# Altium project Passive_Sonar_Rev2.PrjPcb
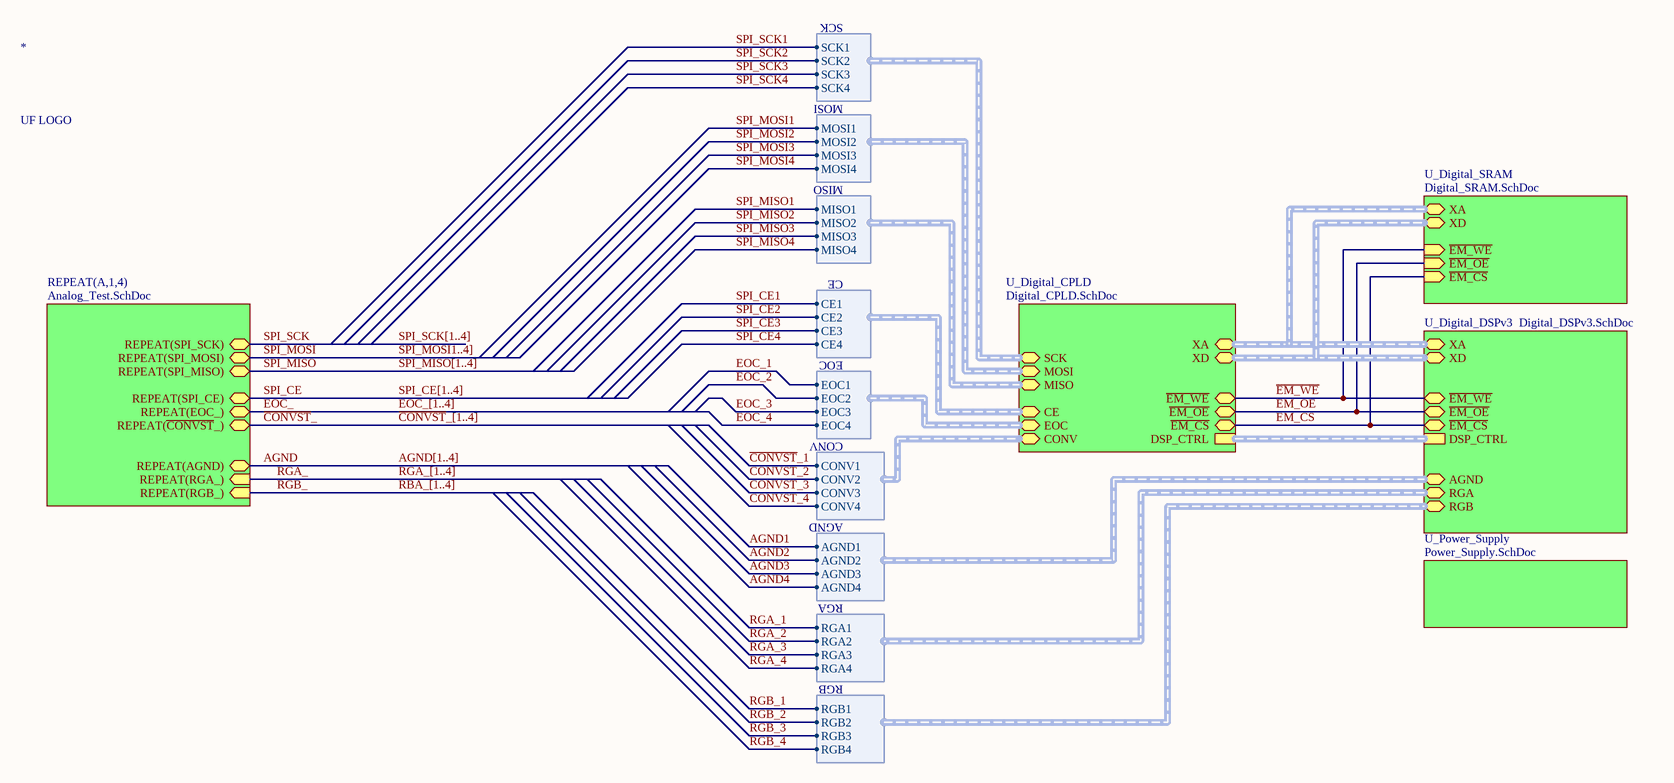
[diagram p0: Top_Level_3.SchDoc]
6 sheets, 265 parts. Net scope: hierarchical (ports join the sheet entries above them; power ports are global).
Board file: Board_Design.PcbDoc
Sheets:
  Top_Level_3.SchDoc
    A1 = Analog_Test.SchDoc
    A2 = Analog_Test.SchDoc
    A3 = Analog_Test.SchDoc
    A4 = Analog_Test.SchDoc
    U_Power_Supply = Power_Supply.SchDoc
    U_Digital_SRAM = Digital_SRAM.SchDoc
    U_Digital_CPLD = Digital_CPLD.SchDoc
  Digital_DSP.SchDoc

## Sheet Top_Level_3.SchDoc
size 381 x 241 mm

### Parts
*  UF LOGO  [UF LOGO-1000]
MIL  MIL LOGO  [MIL LOGO - 500]  (value not drawn)

### Sub-sheets
REPEAT(A,1,4) = Analog_Test.SchDoc: REPEAT(RGA_) (in), REPEAT(RGB_) (in), REPEAT(SPI_SCK) (bidir), REPEAT(SPI_MISO) (bidir), REPEAT(SPI_CE) (bidir), REPEAT(~{CONVST}_) (bidir), REPEAT(EOC_) (bidir), REPEAT(AGND) (bidir), REPEAT(SPI_MOSI) (bidir)
U_Digital_CPLD = Digital_CPLD.SchDoc: ~{EM_OE} (bidir), ~{EM_CS} (bidir), ~{EM_WE} (bidir), DSP_CTRL (harness DSP_CTRL), XA (harness XA), XD (harness XD), SCK (harness SCK), MOSI (harness MOSI), MISO (harness MISO), CE (harness CE), EOC (harness EOC), CONV (harness CONV)
U_Digital_DSPv3 = Digital_DSPv3.SchDoc (file not in this document): ~{EM_WE} (bidir), ~{EM_OE} (bidir), ~{EM_CS} (bidir), DSP_CTRL (harness DSP_CTRL), XA (harness XA), XD (harness XD), AGND (harness AGND), RGA (harness RGA), RGB (harness RGB)
U_Digital_SRAM = Digital_SRAM.SchDoc: ~{EM_CS} (in), ~{EM_WE} (in), ~{EM_OE} (in), XD (harness XD), XA (harness XA)
U_Power_Supply = Power_Supply.SchDoc: no entries

### Harnesses
SCK: SCK1, SCK2, SCK3, SCK4
MOSI: MOSI1, MOSI2, MOSI3, MOSI4
MISO: MISO1, MISO2, MISO3, MISO4
CE: CE1, CE2, CE3, CE4
EOC: EOC1, EOC2, EOC3, EOC4
CONV: CONV1, CONV2, CONV3, CONV4
AGND: AGND1, AGND2, AGND3, AGND4
RGA: RGA1, RGA2, RGA3, RGA4
RGB: RGB1, RGB2, RGB3, RGB4

### Nets
AGND: sheet REPEAT(A,1,4)/REPEAT(AGND)
~{CONVST}_: sheet REPEAT(A,1,4)/REPEAT(~{CONVST}_)
~{EM_CS}: sheet U_Digital_DSPv3/~{EM_CS}, sheet U_Digital_SRAM/~{EM_CS}, sheet U_Digital_CPLD/~{EM_CS}
~{EM_OE}: sheet U_Digital_DSPv3/~{EM_OE}, sheet U_Digital_SRAM/~{EM_OE}, sheet U_Digital_CPLD/~{EM_OE}
~{EM_WE}: sheet U_Digital_DSPv3/~{EM_WE}, sheet U_Digital_SRAM/~{EM_WE}, sheet U_Digital_CPLD/~{EM_WE}
EOC_: sheet REPEAT(A,1,4)/REPEAT(EOC_)
RGA_: sheet REPEAT(A,1,4)/REPEAT(RGA_)
RGB_: sheet REPEAT(A,1,4)/REPEAT(RGB_)
SPI_CE: sheet REPEAT(A,1,4)/REPEAT(SPI_CE)
SPI_MISO: sheet REPEAT(A,1,4)/REPEAT(SPI_MISO)
SPI_MOSI: sheet REPEAT(A,1,4)/REPEAT(SPI_MOSI)
SPI_SCK: sheet REPEAT(A,1,4)/REPEAT(SPI_SCK)

### Buses and harness runs
bus AGND[1..4]
bus EOC_[1..4]
bus RBA_[1..4]
bus RGA_[1..4]
bus SPI_CE[1..4]
bus SPI_MISO[1..4]
bus SPI_MOSI1..4]
bus SPI_SCK[1..4]
bus ~{CONVST}_[1..4]
harness sheet U_Digital_CPLD/DSP_CTRL = sheet U_Digital_DSPv3/DSP_CTRL
harness sheet U_Digital_CPLD/XA = sheet U_Digital_DSPv3/XA = sheet U_Digital_SRAM/XA
harness sheet U_Digital_CPLD/XD = sheet U_Digital_DSPv3/XD = sheet U_Digital_SRAM/XD

## Sheet Analog_Test.SchDoc
size A
Used 4 times, as channels A1, A2, A3, A4. Parts and nets are listed once, with the designators drawn on the sheet.
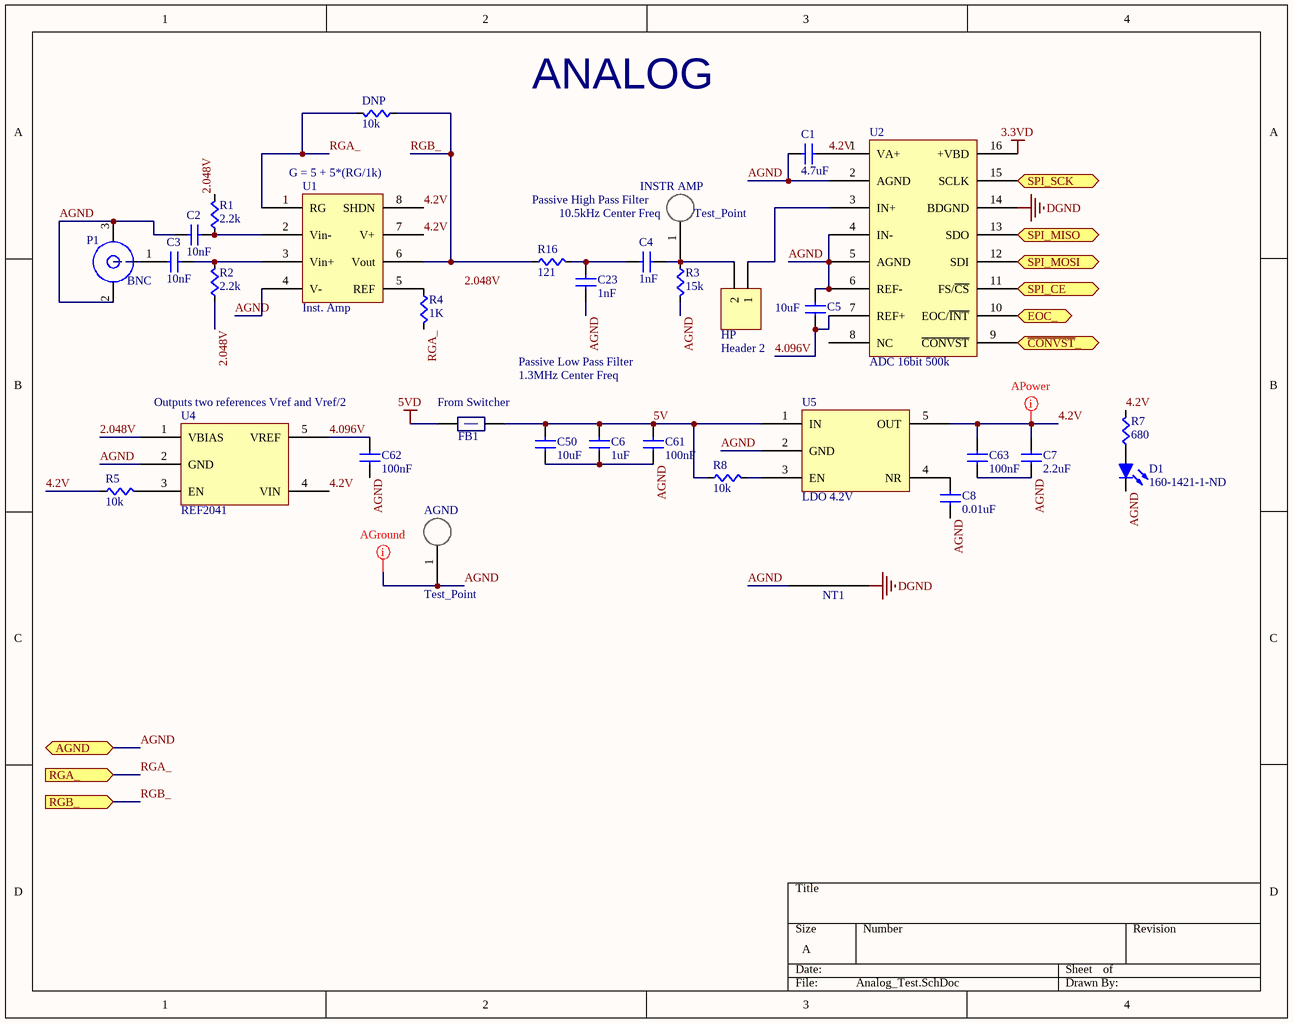
[diagram p1: Analog_Test.SchDoc]

### Parts
AGND  Test_Point  [TP]
C1  value 4.7uF  [CAPC0603]  (hidden comment: Cap)
C2  value 10nF  [CAPC0603]  (hidden comment: Cap)
C3  value 10nF  [CAPC0603]  (hidden comment: Cap)
C4  value 1nF  [CAPC0603]  (hidden comment: Cap)
C5  value 10uF  [CAPC0603]  (hidden comment: Cap)
C6  value 1uF  [CAPC0603]  (hidden comment: Cap)
C7  value 2.2uF  [CAPC0603]  (hidden comment: Cap)
C8  value 0.01uF  [CAPC0603]  (hidden comment: Cap)
C23  value 1nF  [CAPC0603]  (hidden comment: Cap)
C50  value 10uF  [CAPC0603]  (hidden comment: Cap)
C61  value 100nF  [CAPC0603]  (hidden comment: Cap)
C62  value 100nF  [CAPC0603]  (hidden comment: Cap)
C63  value 100nF  [CAPC0603]  (hidden comment: Cap)
D1  Supplier Part Number: 160-1421-1-ND  [LED0805-RED]  (hidden comment: LED-RED)
DNP  value 10k  [RES0603]  (hidden comment: Res)
FB1  FBead  [RES0603]  (value not drawn)
HP  Header 2  [HDR1X2]
INSTR_AMP  Test_Point  [TP]
NT1  NetTie  [NT_5mil]  (value not drawn)  (net tie, no BOM)
P1  BNC  [BNC Connector]
R1  value 2.2k  [RES0603]  (hidden comment: Res)
R2  value 2.2k  [RES0603]  (hidden comment: Res)
R3  value 15k  [RES0603]  (hidden comment: Res)
R4  value 1K  [RES0603]  (hidden comment: Res)
R5  value 10k  [RES0603]  (hidden comment: Res)
R7  value 680  [RES0603]  (hidden comment: Res)
R8  value 10k  [RES0603]  (hidden comment: Res)
R16  value 121  [RES0603]  (hidden comment: Res)
U1  Inst. Amp  [TSSOP-8n]
U2  ADC 16bit 500k  [TSSOP-16pin]
U4  REF2041  [SOT23-5]
U5  LDO 4.2V  [sot23-5]

### Ports
AGND (bidir), EOC_ (bidir), RGA_ (in), RGB_ (in), SPI_CE (bidir), SPI_MISO (bidir), SPI_MOSI (bidir), SPI_SCK (bidir), ~{CONVST}_ (bidir)

### Nets
3.3VD: U2.16(+VBD)
5VD: FB1.1(A)
DGND: NT1.2 U2.14(BDGND)
2.048V: R1.1(A) R2.2(B) U4.1(VBIAS)
4.2V: C1.2(B) C7.2(B) C63.1(A) R5.2(B) R7.1(A) U1.7(V+) U1.8(SHDN) U2.1(VA+) U4.4(VIN) U5.5(OUT)
4.096V: C5.2(B) C62.1(A) U2.7(REF+) U4.5(VREF)
5V: C6.2(B) C50.1(A) C61.1(A) FB1.2(B) R8.2(B) U5.1(IN)
AGND: AGND.1 C1.1(A) C2.1(A) C5.1(A) C6.1(A) C7.1(A) C8.1(A) C23.1(A) C50.2(B) C61.2(B) C62.2(B) C63.2(B) D1.1(K) NT1.1 P1.2(GND) P1.3(GND) R3.1(A) U1.4(V-) U2.2(AGND) U2.4(IN-) U2.5(AGND) U2.6(REF-) U4.2(GND) U5.2(GND) ; port AGND
~{CONVST}_: U2.9(~{CONVST}) ; port ~{CONVST}_
EOC_: U2.10(EOC/~{INT}) ; port EOC_
RGA_: DNP.1(A) R4.1(A) U1.1(RG) ; port RGA_
RGB_: DNP.2(B) R16.2(B) U1.6(Vout) ; port RGB_
SPI_CE: U2.11(FS/~{CS}) ; port SPI_CE
SPI_MISO: U2.13(SDO) ; port SPI_MISO
SPI_MOSI: U2.12(SDI) ; port SPI_MOSI
SPI_SCK: U2.15(SCLK) ; port SPI_SCK
NetC2_2: C2.2(B) R1.2(B) U1.2(Vin-)
NetC3_1: C3.1(A) P1.1(Signal)
NetC3_2: C3.2(B) R2.1(A) U1.3(Vin+)
NetC4_1: C4.1(A) C23.2(B) R16.1(A)
NetC4_2: C4.2(B) HP.2 INSTR_AMP.1 R3.2(B)
NetC8_2: C8.2(B) U5.4(NR)
NetD1_2: D1.2(A) R7.2(B)
NetHP_1: HP.1 U2.3(IN+)
NetR4_2: R4.2(B) U1.5(REF)
NetR5_1: R5.1(A) U4.3(EN)
NetR8_1: R8.1(A) U5.3(EN)

Not connected (* = marked no-connect by the designer): U2 8(NC)

### Channels
A1: designators AGND=AGND_A1 C1=C1_A1 C2=C2_A1 C3=C3_A1 C4=C4_A1 C5=C5_A1 C6=C6_A1 C7=C7_A1 C8=C8_A1 C23=C23_A1 C50=C50_A1 C61=C61_A1 C62=C62_A1 C63=C63_A1 D1=D1_A1 DNP=DNP_A1 FB1=FB1_A1 HP=HP_A1 INSTR AMP=INSTR_AMP_A1 NT1=NT1_A1 P1=P1_A1 R1=R1_A1 R2=R2_A1 R3=R3_A1 R4=R4_A1 R5=R5_A1 R7=R7_A1 R8=R8_A1 R16=R16_A1 U1=U1_A1 U2=U2_A1 U4=U4_A1 U5=U5_A1; ports AGND=AGND_A1 EOC_=EOC_1 RGA_=RGA__A1 RGB_=RGB__A1 SPI_CE=SPI_CE1 SPI_MISO=SPI_MISO1 SPI_MOSI=SPI_MOSI1 SPI_SCK=SPI_SCK1 ~{CONVST}_=~{CONVST}_1
A2: designators AGND=AGND_A2 C1=C1_A2 C2=C2_A2 C3=C3_A2 C4=C4_A2 C5=C5_A2 C6=C6_A2 C7=C7_A2 C8=C8_A2 C23=C23_A2 C50=C50_A2 C61=C61_A2 C62=C62_A2 C63=C63_A2 D1=D1_A2 DNP=DNP_A2 FB1=FB1_A2 HP=HP_A2 INSTR AMP=INSTR_AMP_A2 NT1=NT1_A2 P1=P1_A2 R1=R1_A2 R2=R2_A2 R3=R3_A2 R4=R4_A2 R5=R5_A2 R7=R7_A2 R8=R8_A2 R16=R16_A2 U1=U1_A2 U2=U2_A2 U4=U4_A2 U5=U5_A2; ports AGND=AGND_A2 EOC_=EOC_2 RGA_=RGA__A2 RGB_=RGB__A2 SPI_CE=SPI_CE2 SPI_MISO=SPI_MISO2 SPI_MOSI=SPI_MOSI2 SPI_SCK=SPI_SCK2 ~{CONVST}_=~{CONVST}_2
A3: designators AGND=AGND_A3 C1=C1_A3 C2=C2_A3 C3=C3_A3 C4=C4_A3 C5=C5_A3 C6=C6_A3 C7=C7_A3 C8=C8_A3 C23=C23_A3 C50=C50_A3 C61=C61_A3 C62=C62_A3 C63=C63_A3 D1=D1_A3 DNP=DNP_A3 FB1=FB1_A3 HP=HP_A3 INSTR AMP=INSTR_AMP_A3 NT1=NT1_A3 P1=P1_A3 R1=R1_A3 R2=R2_A3 R3=R3_A3 R4=R4_A3 R5=R5_A3 R7=R7_A3 R8=R8_A3 R16=R16_A3 U1=U1_A3 U2=U2_A3 U4=U4_A3 U5=U5_A3; ports AGND=AGND_A3 EOC_=EOC_3 RGA_=RGA__A3 RGB_=RGB__A3 SPI_CE=SPI_CE3 SPI_MISO=SPI_MISO3 SPI_MOSI=SPI_MOSI3 SPI_SCK=SPI_SCK3 ~{CONVST}_=~{CONVST}_3
A4: designators AGND=AGND_A4 C1=C1_A4 C2=C2_A4 C3=C3_A4 C4=C4_A4 C5=C5_A4 C6=C6_A4 C7=C7_A4 C8=C8_A4 C23=C23_A4 C50=C50_A4 C61=C61_A4 C62=C62_A4 C63=C63_A4 D1=D1_A4 DNP=DNP_A4 FB1=FB1_A4 HP=HP_A4 INSTR AMP=INSTR_AMP_A4 NT1=NT1_A4 P1=P1_A4 R1=R1_A4 R2=R2_A4 R3=R3_A4 R4=R4_A4 R5=R5_A4 R7=R7_A4 R8=R8_A4 R16=R16_A4 U1=U1_A4 U2=U2_A4 U4=U4_A4 U5=U5_A4; ports AGND=AGND_A4 EOC_=EOC_4 RGA_=RGA__A4 RGB_=RGB__A4 SPI_CE=SPI_CE4 SPI_MISO=SPI_MISO4 SPI_MOSI=SPI_MOSI4 SPI_SCK=SPI_SCK4 ~{CONVST}_=~{CONVST}_4

### Layout directives
net class AGround: AGND_A1
net class APower: 4.2V_A1

### Notes on the sheet
- ANALOG
- (near U1) G = 5 + 5*(RG/1k)
- (near INSTR_AMP) Passive High Pass Filter
- (near INSTR_AMP) 10.5kHz Center Freq
- Passive Low Pass Filter
- Outputs two references Vref and Vref/2
- (near FB1) From Switcher
- 1.3MHz Center Freq
- Labels drawn without touching a wire or pin: 2.048V

### Library data of the parts
AGND INSTR_AMP = Test_Point: TEST POINT PC COMPACT .063"D; Supplier 1: Digi-Key; Supplier Part Number 1: 5006K-ND
D1 = LED-RED: Light Emitting Diode - RED; Manufacturer Part Number: LTST-C171CKT; Manufacturer: Lite-On Inc; Voltage - Forward (Vf) Typ: 1.8V; Current - Test: 20mA; Millicandela Rating: 25mcd; Viewing Angle: 130°; Color: Red; Supplier: Digi-Key; Package / Case: 0805 (2012 Metric)
FB1 = FBead: Ferrite Bead; Supplier 1: Digi-Key; Supplier Part Number 1: 445-2988-1-ND
HP = Header 2: Header, 2-Pin; LatestRevisionDate: 17-Jul-2002; LatestRevisionNote: Re-released for DXP Platform.; Publisher: Altium Limited
NT1 = NetTie: Ties two nets together
P1 = BNC Connector: CONN BNC JACK R/A 50 OHM PCB; Suplier 1: Digi-Key; Supplier Part Number 1: WM5524-ND
U1 = INA331: IC OPAMP INSTR 2MHZ RRO 8VSSOP; Suplier Part Number 1: 296-12202-1-ND; Supplier 1: Digi-Key
U2 = ADC 16bit 500k: IC ADC 16BIT 500KSPS 16-TSSOP; Supplier 1: Digi-Key; Supplier Part Number 1: 296-19764-ND
U4 = REF2041: IC VREF SERIES 2.05V/4.096V 5SOT; Supplier 1: Digi-Key; Supplier Part Number 1: 296-38497-1-ND
U5 = LDO 4.2V 200mA: IC REG LDO 4.2V 0.2A 5SOT; Supplier 1: Digi-Key; Supplier Part Number 1: 296-32585-1-ND
C1-C8 C23 C50 C61-C63 = Cap: Supplier 1: Digi-Key; Supplier Part Number 1: 1276-1000-1-ND
DNP R1-R5 R7 R8 R16 = Res: Supplier 1: Digi-Key; Supplier Part Number 1: RMCF0603JT10K0CT-ND

## Sheet Power_Supply.SchDoc
size A
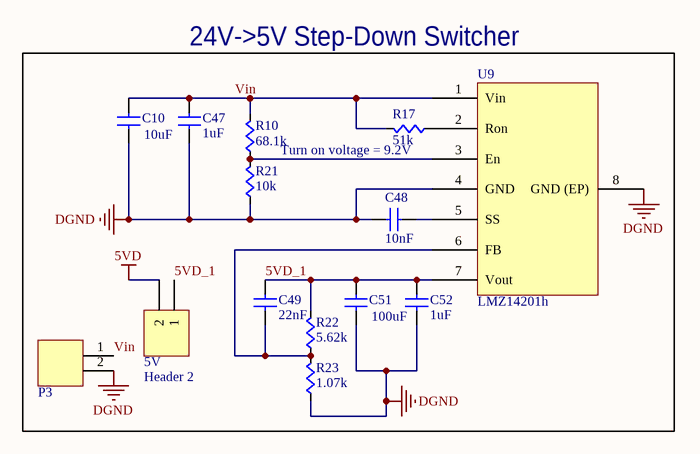
[diagram p2: Power_Supply.SchDoc]

### Parts
5V  Header 2  [HDR1X2]
C10  value 10uF  [CAP1210]  (hidden comment: CAP1210)
C47  value 1uF  [CAP1206]  (hidden comment: Cap1206)
C48  value 10nF  [CAPC0603]  (hidden comment: Cap)
C49  value 22nF  [CAPC0603]  (hidden comment: Cap)
C51  value 100uF  [CAP1210]  (hidden comment: CAP1210)
C52  value 1uF  [CAP1206]  (hidden comment: Cap1206)
P3  2-pin Horz Sherlock  [MOLEX-HDR-1X2-SHERLOCK-HORZ]  (value not drawn)
R10  value 68.1k  [RES0603]  (hidden comment: Res)
R17  value 51k  [RES0603]  (hidden comment: Res)
R21  value 10k  [RES0603]  (hidden comment: Res)
R22  value 5.62k  [RES0603]  (hidden comment: Res)
R23  value 1.07k  [RES0603]  (hidden comment: Res)
U9  LMZ14201h  [TO-PMOD-7]

### Nets
5VD: 5V.2
DGND: C10.2(B) C47.2(B) C48.1(A) C51.2(B) C52.2(B) P3.2 R21.2(B) R23.2(B) U9.4(GND) U9.8(GND_(EP))
5VD_1: 5V.1 C49.2(B) C51.1(A) C52.1(A) R22.1(A) U9.7(Vout)
Vin: C10.1(A) C47.1(A) P3.1 R10.1(A) R17.1(A) U9.1(Vin)
NetC48_2: C48.2(B) U9.5(SS)
NetC49_1: C49.1(A) R22.2(B) R23.1(A) U9.6(FB)
NetR10_2: R10.2(B) R21.1(A) U9.3(En)
NetR17_2: R17.2(B) U9.2(Ron)

### Notes on the sheet
- 24V->5V Step-Down Switcher
- (near R17) Turn on voltage = 9.2V

### Library data of the parts
5V = Header 2: Header, 2-Pin; LatestRevisionDate: 17-Jul-2002; LatestRevisionNote: Re-released for DXP Platform.; Publisher: Altium Limited
C10 C51 = CAP1210: CAP CER 10UF 50V 20% X5R 1210; Supplier 1: Digi-Key
  C10: Supplier Part Number 1: 587-2225-1-ND
  C51: Supplier Part Number 1: 587-1387-1-ND
C47 C52 = Cap1206: CAP CER 1UF 50V 10% X7R 1206; Supplier 1: Digi-Key; Supplier Part Number 1: 587-2230-1-ND
P3 = MOLEX-HDR-1x2-SHERLOCK_RA: Header, Molex, 2mm Pitch Sherlock Header, Single Row, Horizontal, 2 Circuits, Length 3.3mm,  0353630260; Manufacturer: Molex Inc; Manufacturer Part Number: 0353630260; Supplier Part Number 1: WM18931-ND; Supplier 1: Digi-Key
U9 = LMZ14201h: IC BUCK SYNC ADJ 1A TO-PMOD-7; Supplier 1: Digi-Key; Supplier Part Number 1: LMZ14201HTZX/NOPBCT-ND
C48 C49 = Cap: Supplier 1: Digi-Key; Supplier Part Number 1: 1276-1000-1-ND
R10 R17 R21-R23 = Res: Supplier 1: Digi-Key; Supplier Part Number 1: RMCF0603JT10K0CT-ND

## Sheet Digital_SRAM.SchDoc
size A
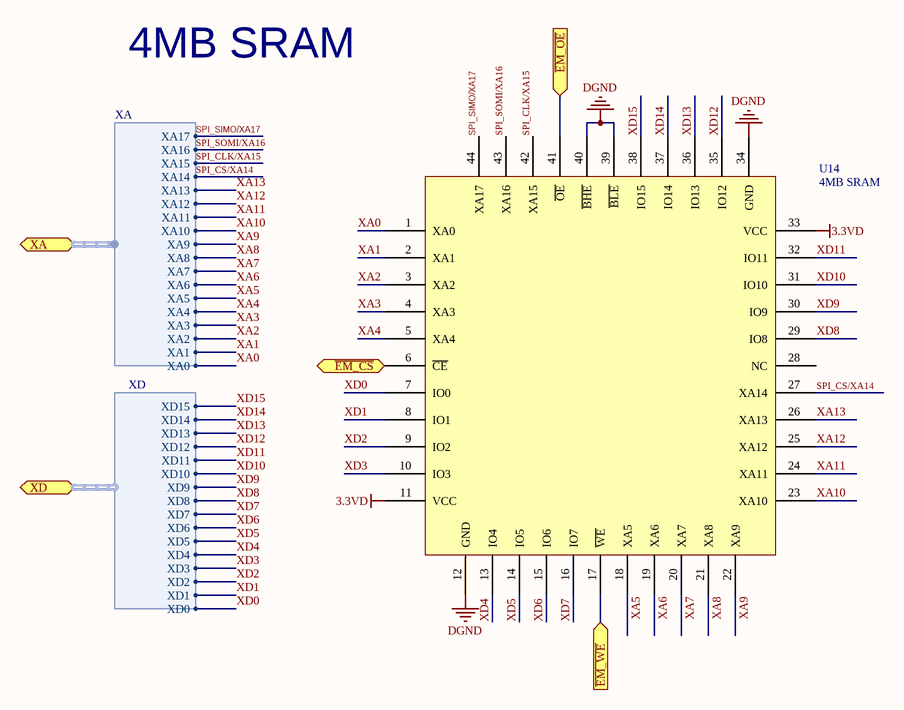
[diagram p3: Digital_SRAM.SchDoc]

### Parts
U14  4MB SRAM  [TSOP-44]

### Ports
XA (harness XA), XD (harness XD), ~{EM_CS} (in), ~{EM_OE} (in), ~{EM_WE} (in)

### Harnesses
XA: XA17, XA16, XA15, XA14, XA13, XA12, XA11, XA10, XA9, XA8, XA7, XA6, XA5, XA4, XA3, XA2, XA1, XA0
XD: XD15, XD14, XD13, XD12, XD11, XD10, XD9, XD8, XD7, XD6, XD5, XD4, XD3, XD2, XD1, XD0

### Nets
3.3VD: U14.11(VCC) U14.33(VCC)
DGND: U14.12(GND) U14.34(GND) U14.39(~{BLE}) U14.40(~{BHE})
~{EM_CS}: U14.6(~{CE}) ; port ~{EM_CS}
~{EM_OE}: U14.41(~{OE}) ; port ~{EM_OE}
~{EM_WE}: U14.17(~{WE}) ; port ~{EM_WE}
SPI_CLK/XA15: U14.42(XA15) ; port XA.XA15
SPI_CS/XA14: U14.27(XA14) ; port XA.XA14
SPI_SIMO/XA17: U14.44(XA17) ; port XA.XA17
SPI_SOMI/XA16: U14.43(XA16) ; port XA.XA16
XA0: U14.1(XA0) ; port XA.XA0
XA1: U14.2(XA1) ; port XA.XA1
XA2: U14.3(XA2) ; port XA.XA2
XA3: U14.4(XA3) ; port XA.XA3
XA4: U14.5(XA4) ; port XA.XA4
XA5: U14.18(XA5) ; port XA.XA5
XA6: U14.19(XA6) ; port XA.XA6
XA7: U14.20(XA7) ; port XA.XA7
XA8: U14.21(XA8) ; port XA.XA8
XA9: U14.22(XA9) ; port XA.XA9
XA10: U14.23(XA10) ; port XA.XA10
XA11: U14.24(XA11) ; port XA.XA11
XA12: U14.25(XA12) ; port XA.XA12
XA13: U14.26(XA13) ; port XA.XA13
XD0: U14.7(IO0) ; port XD.XD0
XD1: U14.8(IO1) ; port XD.XD1
XD2: U14.9(IO2) ; port XD.XD2
XD3: U14.10(IO3) ; port XD.XD3
XD4: U14.13(IO4) ; port XD.XD4
XD5: U14.14(IO5) ; port XD.XD5
XD6: U14.15(IO6) ; port XD.XD6
XD7: U14.16(IO7) ; port XD.XD7
XD8: U14.29(IO8) ; port XD.XD8
XD9: U14.30(IO9) ; port XD.XD9
XD10: U14.31(IO10) ; port XD.XD10
XD11: U14.32(IO11) ; port XD.XD11
XD12: U14.35(IO12) ; port XD.XD12
XD13: U14.36(IO13) ; port XD.XD13
XD14: U14.37(IO14) ; port XD.XD14
XD15: U14.38(IO15) ; port XD.XD15

Not connected (* = marked no-connect by the designer): U14 28(NC)

### Notes on the sheet
- 4MB SRAM

### Library data of the parts
U14 = CY7C1041CV33-8ZSXI: IC SRAM 4MBIT 8NS 44TSOP; Supplier 1: Digi-Key; Supplier Part Number 1: 428-3284-ND

## Sheet Digital_CPLD.SchDoc
size 381 x 381 mm
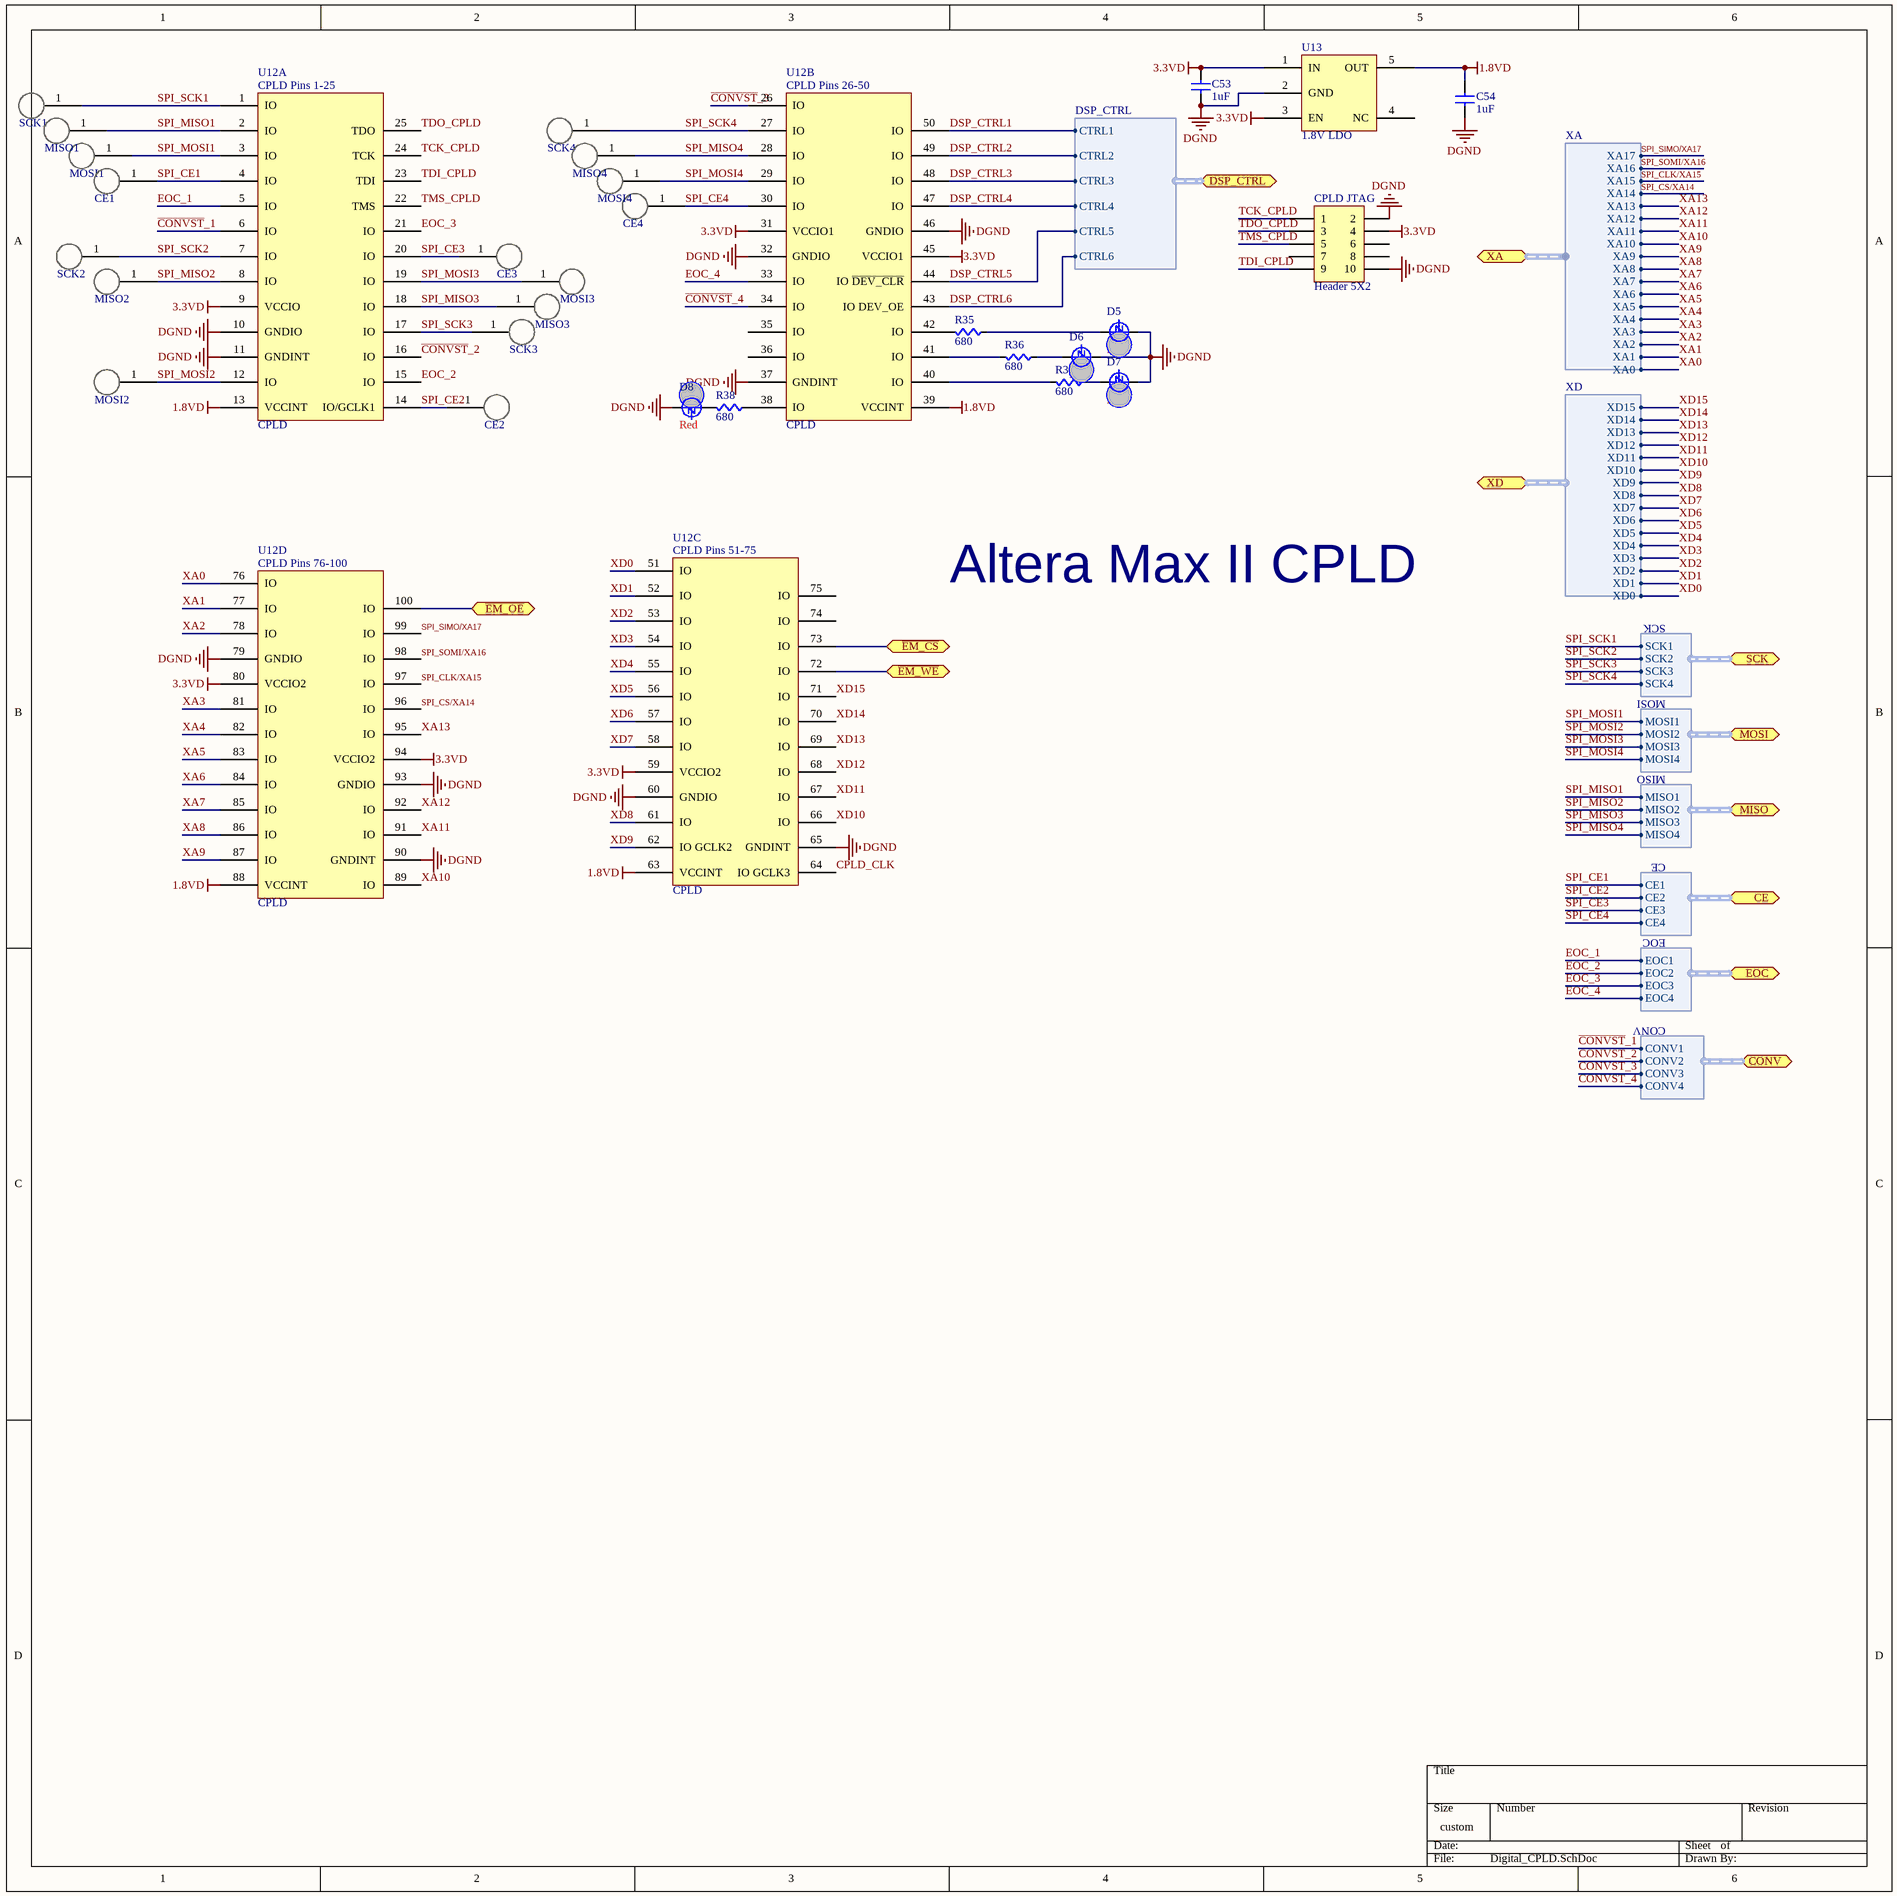
[diagram p4: Digital_CPLD.SchDoc]

### Parts
(Parts that share a designator on the sheet are numbered #1, #2 ... from top to bottom, then left to right.)
C53  value 1uF  [CAPC0603]  (hidden comment: Cap)
C54  value 1uF  [CAPC0603]  (hidden comment: Cap)
CE1  Test_Point  [TP]  (value not drawn)
CE2  Test_Point  [TP]  (value not drawn)
CE3  Test_Point  [TP]  (value not drawn)
CE4  Test_Point  [TP]  (value not drawn)
CPLD_JTAG  Header 5X2  [HDR2X5]
D5#1  Color: Red  [LED0603]  (hidden comment: LED)
D6  Color: Red  [LED0603]  (hidden comment: LED)
D7  Color: Red  [LED0603]  (hidden comment: LED)
D8  Color: Red  [LED0603]  (hidden comment: LED)
MISO1  Test_Point  [TP]  (value not drawn)
MISO2  Test_Point  [TP]  (value not drawn)
MISO3  Test_Point  [TP]  (value not drawn)
MISO4  Test_Point  [TP]  (value not drawn)
MOSI1  Test_Point  [TP]  (value not drawn)
MOSI2  Test_Point  [TP]  (value not drawn)
MOSI3  Test_Point  [TP]  (value not drawn)
MOSI4  Test_Point  [TP]  (value not drawn)
R35  value 680  [RES0603]  (hidden comment: Res)
R36  value 680  [RES0603]  (hidden comment: Res)
R37  value 680  [RES0603]  (hidden comment: Res)
R38  value 680  [RES0603]  (hidden comment: Res)
SCK1  Test_Point  [TP]  (value not drawn)
SCK2  Test_Point  [TP]  (value not drawn)
SCK3  Test_Point  [TP]  (value not drawn)
SCK4  Test_Point  [TP]  (value not drawn)
U12  CPLD  [TQFP-100]  (parts A,B,C,D of 4)
U13  1.8V LDO  [SOT23-5n]

### Ports
CE (harness CE), CONV (harness CONV), DSP_CTRL (harness DSP_CTRL), EOC (harness EOC), MISO (harness MISO), MOSI (harness MOSI), SCK (harness SCK), XA (harness XA), XD (harness XD), ~{EM_CS} (bidir), ~{EM_OE} (bidir), ~{EM_WE} (bidir)

### Harnesses
DSP_CTRL: CTRL1, CTRL2, CTRL3, CTRL4, CTRL5, CTRL6
XA: XA17, XA16, XA15, XA14, XA13, XA12, XA11, XA10, XA9, XA8, XA7, XA6, XA5, XA4, XA3, XA2, XA1, XA0
XD: XD15, XD14, XD13, XD12, XD11, XD10, XD9, XD8, XD7, XD6, XD5, XD4, XD3, XD2, XD1, XD0
CE: CE1, CE2, CE3, CE4
MISO: MISO1, MISO2, MISO3, MISO4
EOC: EOC1, EOC2, EOC3, EOC4
MOSI: MOSI1, MOSI2, MOSI3, MOSI4
SCK: SCK1, SCK2, SCK3, SCK4
CONV: CONV1, CONV2, CONV3, CONV4

### Nets
1.8VD: C54.1(A) U12.13(VCCINT) U12.39(VCCINT) U12.63(VCCINT) U12.88(VCCINT) U13.5(OUT)
3.3VD: C53.1(A) CPLD_JTAG.4 U12.9(VCCIO) U12.31(VCCIO1) U12.45(VCCIO1) U12.59(VCCIO2) U12.80(VCCIO2) U12.94(VCCIO2) U13.1(IN) U13.3(EN)
DGND: C53.2(B) C54.2(B) CPLD_JTAG.2 CPLD_JTAG.10 D5#1.C D6.C D7.C D8.C U12.10(GNDIO) U12.11(GNDINT) U12.32(GNDIO) U12.37(GNDINT) U12.46(GNDIO) U12.60(GNDIO) U12.65(GNDINT) U12.79(GNDIO) U12.90(GNDINT) U12.93(GNDIO) U13.2(GND)
~{CONVST}_1: U12.6(IO) ; port CONV.CONV1
~{CONVST}_2: U12.16(IO) ; port CONV.CONV2
~{CONVST}_3: U12.26(IO) ; port CONV.CONV3
~{CONVST}_4: U12.34(IO) ; port CONV.CONV4
CPLD_CLK: U12.64(IO_GCLK3)
DSP_CTRL1: U12.50(IO) ; port DSP_CTRL.CTRL1
DSP_CTRL2: U12.49(IO) ; port DSP_CTRL.CTRL2
DSP_CTRL3: U12.48(IO) ; port DSP_CTRL.CTRL3
DSP_CTRL4: U12.47(IO) ; port DSP_CTRL.CTRL4
DSP_CTRL5: U12.44(IO_~{DEV_CLR}) ; port DSP_CTRL.CTRL5
DSP_CTRL6: U12.43(IO_DEV_OE) ; port DSP_CTRL.CTRL6
~{EM_CS}: U12.73(IO) ; port ~{EM_CS}
~{EM_OE}: U12.100(IO) ; port ~{EM_OE}
~{EM_WE}: U12.72(IO) ; port ~{EM_WE}
EOC_1: U12.5(IO) ; port EOC.EOC1
EOC_2: U12.15(IO) ; port EOC.EOC2
EOC_3: U12.21(IO) ; port EOC.EOC3
EOC_4: U12.33(IO) ; port EOC.EOC4
SPI_CE1: CE1.1 U12.4(IO) ; port CE.CE1
SPI_CE2: CE2.1 U12.14(IO/GCLK1) ; port CE.CE2
SPI_CE3: CE3.1 U12.20(IO) ; port CE.CE3
SPI_CE4: CE4.1 U12.30(IO) ; port CE.CE4
SPI_CLK/XA15: U12.97(IO) ; port XA.XA15
SPI_CS/XA14: U12.96(IO) ; port XA.XA14
SPI_MISO1: MISO1.1 U12.2(IO) ; port MISO.MISO1
SPI_MISO2: MISO2.1 U12.8(IO) ; port MISO.MISO2
SPI_MISO3: MISO3.1 U12.18(IO) ; port MISO.MISO3
SPI_MISO4: MISO4.1 U12.28(IO) ; port MISO.MISO4
SPI_MOSI1: MOSI1.1 U12.3(IO) ; port MOSI.MOSI1
SPI_MOSI2: MOSI2.1 U12.12(IO) ; port MOSI.MOSI2
SPI_MOSI3: MOSI3.1 U12.19(IO) ; port MOSI.MOSI3
SPI_MOSI4: MOSI4.1 U12.29(IO) ; port MOSI.MOSI4
SPI_SCK1: SCK1.1 U12.1(IO) ; port SCK.SCK1
SPI_SCK2: SCK2.1 U12.7(IO) ; port SCK.SCK2
SPI_SCK3: SCK3.1 U12.17(IO) ; port SCK.SCK3
SPI_SCK4: SCK4.1 U12.27(IO) ; port SCK.SCK4
SPI_SIMO/XA17: U12.99(IO) ; port XA.XA17
SPI_SOMI/XA16: U12.98(IO) ; port XA.XA16
TCK_CPLD: CPLD_JTAG.1 U12.24(TCK)
TDI_CPLD: CPLD_JTAG.9 U12.23(TDI)
TDO_CPLD: CPLD_JTAG.3 U12.25(TDO)
TMS_CPLD: CPLD_JTAG.5 U12.22(TMS)
XA0: U12.76(IO) ; port XA.XA0
XA1: U12.77(IO) ; port XA.XA1
XA2: U12.78(IO) ; port XA.XA2
XA3: U12.81(IO) ; port XA.XA3
XA4: U12.82(IO) ; port XA.XA4
XA5: U12.83(IO) ; port XA.XA5
XA6: U12.84(IO) ; port XA.XA6
XA7: U12.85(IO) ; port XA.XA7
XA8: U12.86(IO) ; port XA.XA8
XA9: U12.87(IO) ; port XA.XA9
XA10: U12.89(IO) ; port XA.XA10
XA11: U12.91(IO) ; port XA.XA11
XA12: U12.92(IO) ; port XA.XA12
XA13: U12.95(IO) ; port XA.XA13
XD0: U12.51(IO) ; port XD.XD0
XD1: U12.52(IO) ; port XD.XD1
XD2: U12.53(IO) ; port XD.XD2
XD3: U12.54(IO) ; port XD.XD3
XD4: U12.55(IO) ; port XD.XD4
XD5: U12.56(IO) ; port XD.XD5
XD6: U12.57(IO) ; port XD.XD6
XD7: U12.58(IO) ; port XD.XD7
XD8: U12.61(IO) ; port XD.XD8
XD9: U12.62(IO_GCLK2) ; port XD.XD9
XD10: U12.66(IO) ; port XD.XD10
XD11: U12.67(IO) ; port XD.XD11
XD12: U12.68(IO) ; port XD.XD12
XD13: U12.69(IO) ; port XD.XD13
XD14: U12.70(IO) ; port XD.XD14
XD15: U12.71(IO) ; port XD.XD15
NetD5#1_A: D5#1.A R35.2(B)
NetD6_A: D6.A R36.2(B)
NetD7_A: D7.A R37.2(B)
NetD8_A: D8.A R38.1(A)
NetR35_1: R35.1(A) U12.42(IO)
NetR36_1: R36.1(A) U12.41(IO)
NetR37_1: R37.1(A) U12.40(IO)
NetR38_2: R38.2(B) U12.38(IO)

Not connected (* = marked no-connect by the designer): CPLD_JTAG 6 7 8; U12 35(IO) 36(IO) 74(IO) 75(IO); U13 4(NC)

### Notes on the sheet
- Altera Max II CPLD
- (in symbol EPM240GT100I5N, part A) CPLD Pins 1-25
- (in symbol EPM240GT100I5N, part B) CPLD Pins 26-50
- (in symbol EPM240GT100I5N, part C) CPLD Pins 51-75
- (in symbol EPM240GT100I5N, part D) CPLD Pins 76-100

### Library data of the parts
CE1-CE4 MISO1-MISO4 MOSI1-MOSI4 SCK1-SCK4 = Test_Point: TEST POINT PC COMPACT .063"D; Supplier 1: Digi-Key; Supplier Part Number 1: 5006K-ND
CPLD_JTAG = Header 5X2: Header, 5-Pin, Dual row; LatestRevisionDate: 17-Jul-2002; LatestRevisionNote: Re-released for DXP Platform.; Publisher: Altium Limited
U12 = EPM240GT100I5N: IC CPLD 192MC 4.7NS 100TQFP; Supplier 1: Digi-Key; Supplier Part Number 1: 544-2275-ND
U13 = LP5907: IC REG LDO 1.8V 0.25A SOT23-5; Supplier 1: Digi-Key; Supplier Part Number 1: 296-41463-2-ND
C53 C54 = Cap: Supplier 1: Digi-Key; Supplier Part Number 1: 1276-1000-1-ND
D5#1 D6-D8 = LED: Supplier 1: Digi-Key; Supplier Part Number 1: 754-1122-1-ND
R35-R38 = Res: Supplier 1: Digi-Key; Supplier Part Number 1: RMCF0603JT10K0CT-ND

## Sheet Digital_DSP.SchDoc
size 508 x 241 mm
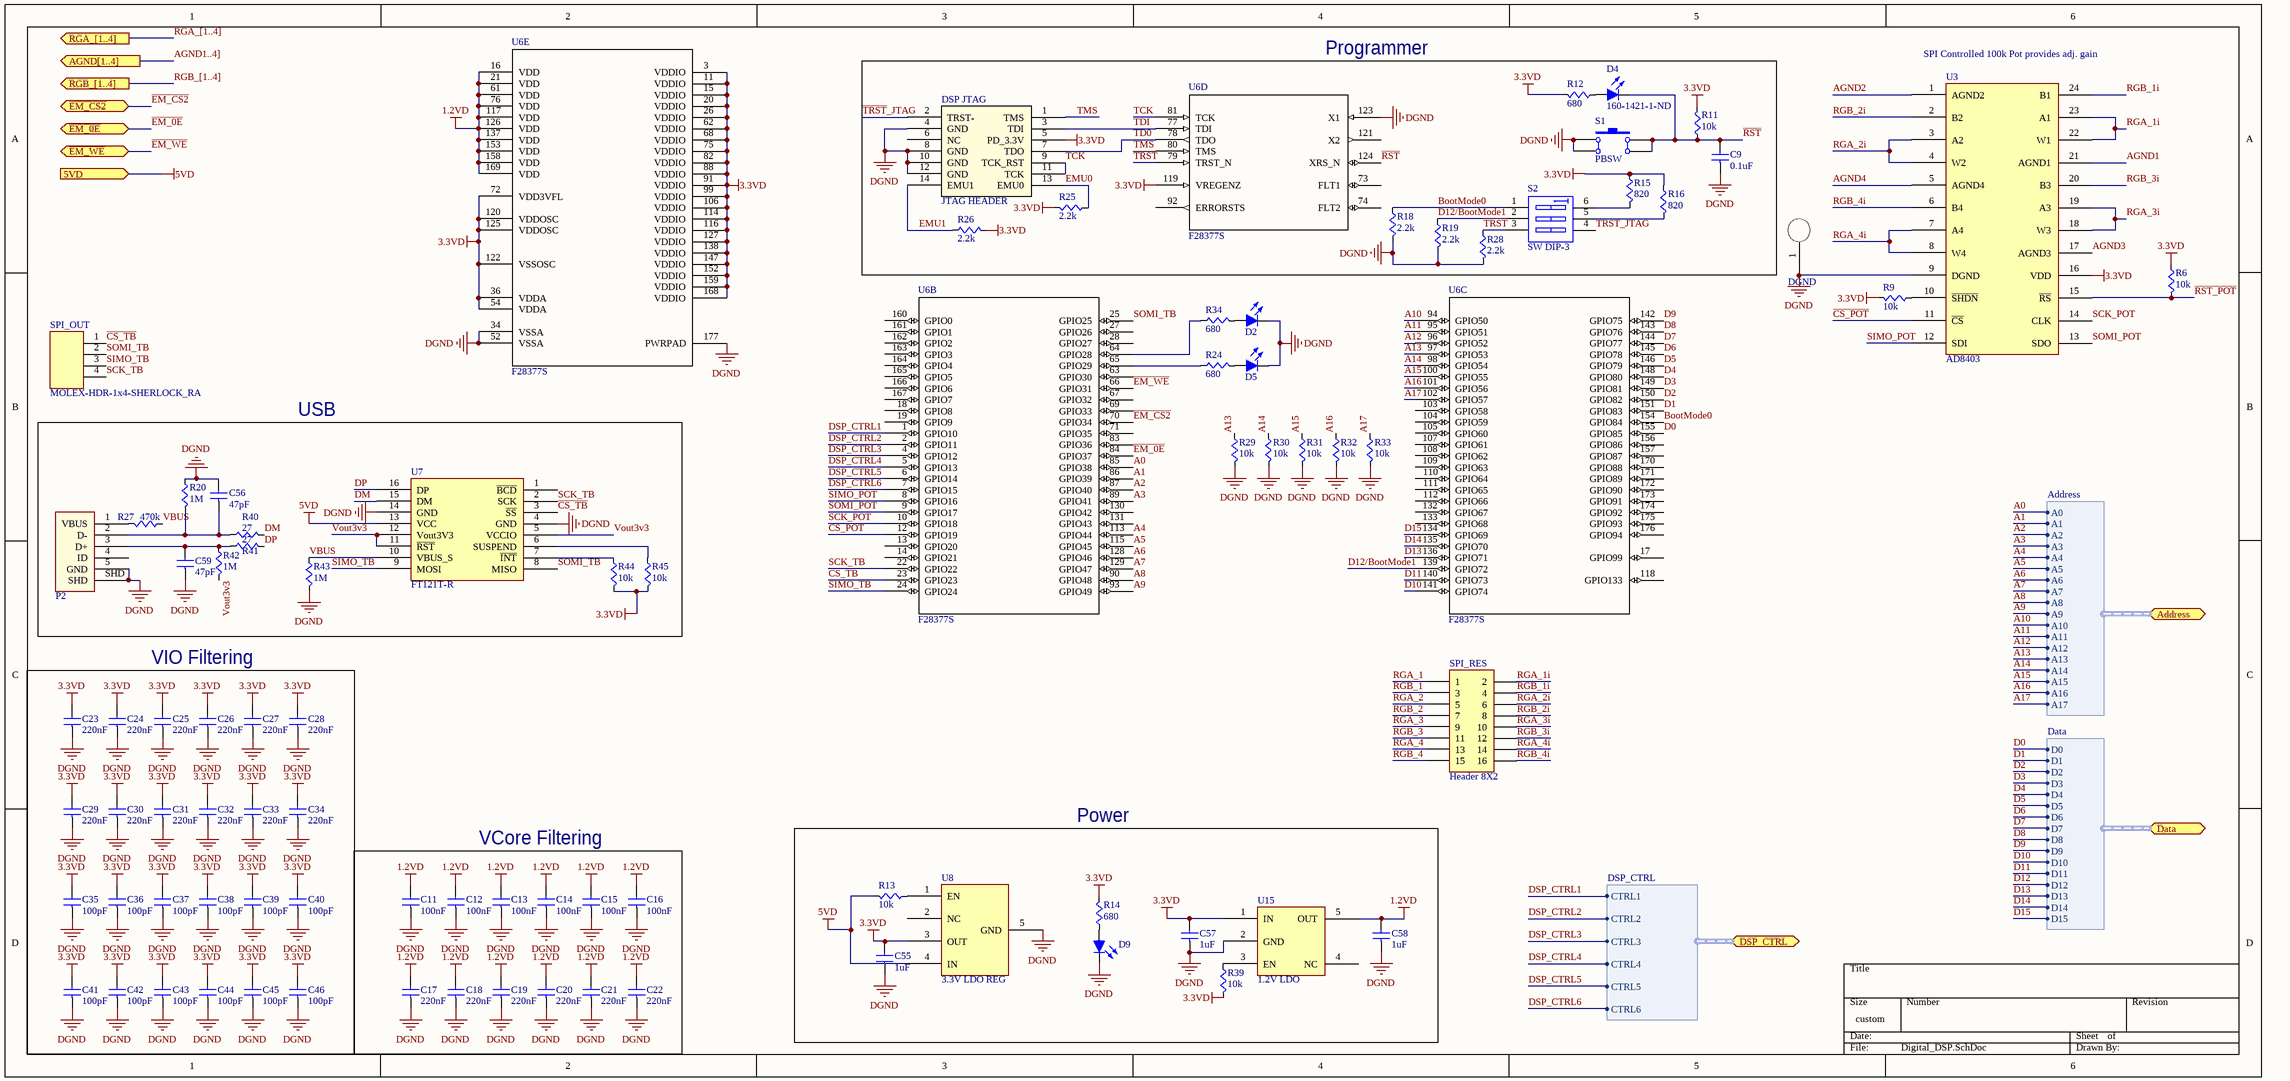
[diagram p5: Digital_DSP.SchDoc]

### Parts
(Parts that share a designator on the sheet are numbered #1, #2 ... from top to bottom, then left to right.)
C9  value 0.1uF  [CAPC0603]  (hidden comment: Cap)
C11  value 100nF  [CAPC0603]  (hidden comment: Cap)
C12  value 100nF  [CAPC0603]  (hidden comment: Cap)
C13  value 100nF  [CAPC0603]  (hidden comment: Cap)
C14  value 100nF  [CAPC0603]  (hidden comment: Cap)
C15  value 100nF  [CAPC0603]  (hidden comment: Cap)
C16  value 100nF  [CAPC0603]  (hidden comment: Cap)
C17  value 220nF  [CAPC0603]  (hidden comment: Cap)
C18  value 220nF  [CAPC0603]  (hidden comment: Cap)
C19  value 220nF  [CAPC0603]  (hidden comment: Cap)
C20  value 220nF  [CAPC0603]  (hidden comment: Cap)
C21  value 220nF  [CAPC0603]  (hidden comment: Cap)
C22  value 220nF  [CAPC0603]  (hidden comment: Cap)
C23  value 220nF  [CAPC0603]  (hidden comment: Cap)
C24  value 220nF  [CAPC0603]  (hidden comment: Cap)
C25  value 220nF  [CAPC0603]  (hidden comment: Cap)
C26  value 220nF  [CAPC0603]  (hidden comment: Cap)
C27  value 220nF  [CAPC0603]  (hidden comment: Cap)
C28  value 220nF  [CAPC0603]  (hidden comment: Cap)
C29  value 220nF  [CAPC0603]  (hidden comment: Cap)
C30  value 220nF  [CAPC0603]  (hidden comment: Cap)
C31  value 220nF  [CAPC0603]  (hidden comment: Cap)
C32  value 220nF  [CAPC0603]  (hidden comment: Cap)
C33  value 220nF  [CAPC0603]  (hidden comment: Cap)
C34  value 220nF  [CAPC0603]  (hidden comment: Cap)
C35  value 100pF  [CAPC0603]  (hidden comment: Cap)
C36  value 100pF  [CAPC0603]  (hidden comment: Cap)
C37  value 100pF  [CAPC0603]  (hidden comment: Cap)
C38  value 100pF  [CAPC0603]  (hidden comment: Cap)
C39  value 100pF  [CAPC0603]  (hidden comment: Cap)
C40  value 100pF  [CAPC0603]  (hidden comment: Cap)
C41  value 100pF  [CAPC0603]  (hidden comment: Cap)
C42  value 100pF  [CAPC0603]  (hidden comment: Cap)
C43  value 100pF  [CAPC0603]  (hidden comment: Cap)
C44  value 100pF  [CAPC0603]  (hidden comment: Cap)
C45  value 100pF  [CAPC0603]  (hidden comment: Cap)
C46  value 100pF  [CAPC0603]  (hidden comment: Cap)
C55  value 1uF  [CAPC0603]  (hidden comment: Cap1206)
C56  value 47pF  [CAPC0603]  (hidden comment: Cap1206)
C57  value 1uF  [CAPC0603]  (hidden comment: Cap1206)
C58  value 1uF  [CAPC0603]  (hidden comment: Cap1206)
C59  value 47pF  [CAPC0603]  (hidden comment: Cap1206)
D2  LED-RED  [LED0805-RED]  (value not drawn)
D4  Supplier Part Number: 160-1421-1-ND  [LED0805-RED]  (hidden comment: LED-RED)
D5#2  LED-RED  [LED0805-RED]  (value not drawn)
D9  LED-RED  [LED0805-RED]  (value not drawn)
DGND  Test_Point  [TP]  (value not drawn)
DSP_JTAG  JTAG HEADER  [JTAG HEADER - 14]
P2  USB Micro  [10118192-0001LF]  (value not drawn)
R6  value 10k  [RES0603]  (hidden comment: Res)
R9  value 10k  [RES0603]  (hidden comment: Res)
R11  value 10k  [RES0603]  (hidden comment: Res)
R12  value 680  [RES0603]  (hidden comment: Res)
R13  value 10k  [RES0603]  (hidden comment: Res)
R14  value 680  [RES0603]  (hidden comment: Res)
R15  value 820  [RES0603]  (hidden comment: Res)
R16  value 820  [RES0603]  (hidden comment: Res)
R18  value 2.2k  [RES0603]  (hidden comment: Res)
R19  value 2.2k  [RES0603]  (hidden comment: Res)
R20  value 1M  [RES0603]  (hidden comment: Res)
R24  value 680  [RES0603]  (hidden comment: Res)
R25  value 2.2k  [RES0603]  (hidden comment: Res)
R26  value 2.2k  [RES0603]  (hidden comment: Res)
R27  value 470k  [RES0603]  (hidden comment: Res)
R28  value 2.2k  [RES0603]  (hidden comment: Res)
R29  value 10k  [RES0603]  (hidden comment: Res)
R30  value 10k  [RES0603]  (hidden comment: Res)
R31  value 10k  [RES0603]  (hidden comment: Res)
R32  value 10k  [RES0603]  (hidden comment: Res)
R33  value 10k  [RES0603]  (hidden comment: Res)
R34  value 680  [RES0603]  (hidden comment: Res)
R39  value 10k  [RES0603]  (hidden comment: Res)
R40  value 27  [RES0603]  (hidden comment: Res)
R41  value 27  [RES0603]  (hidden comment: Res)
R42  value 1M  [RES0603]  (hidden comment: Res)
R43  value 1M  [RES0603]  (hidden comment: Res)
R44  value 10k  [RES0603]  (hidden comment: Res)
R45  value 10k  [RES0603]  (hidden comment: Res)
S1  PBSW  [PBSW]
S2  SW DIP-3  [DIP-6]
SPI_OUT  MOLEX-HDR-1x4-SHERLOCK_RA  [MOLEX-HDR-1X4-SHERLOCK-RA]
SPI_RES  Header 8X2  [HDR2X8]
U3  AD8403  [SOIC-24n]
U6  F28377S  [Tqfp-176]  (parts B,C,D,E of 5)
U7  FT121T-R  [TSSOP-16pin]
U8  3.3V LDO REG  [SOT223-8N]
U15  1.2V LDO  [sot23-5n]

### Blocks framed on the sheet
Programmer: C9 D4 DSP_JTAG R11 R12 R15 R16 R18 R19 R25 R26 R28 S1 S2 U6
USB: C56 C59 P2 R20 R27 R40-R45 U7
VIO Filtering: C23-C46
Power: C55 C57 C58 D9 R13 R14 R39 U8 U15
VCore Filtering: C11-C22

### Ports
5VD (in), Address (harness Address), AGND[1..4] (out), Data (harness Data), DSP_CTRL (harness DSP_CTRL), RGA_[1..4] (out), RGB_[1..4] (out), ~{EM_0E} (bidir), ~{EM_CS2} (bidir), ~{EM_WE} (bidir)

### Harnesses
DSP_CTRL: CTRL1, CTRL2, CTRL3, CTRL4, CTRL5, CTRL6
Address: A0, A1, A2, A3, A4, A5, A6, A7, A8, A9, A10, A11, A12, A13, A14, A15, A16, A17
Data: D0, D1, D2, D3, D4, D5, D6, D7, D8, D9, D10, D11, D12, D13, D14, D15

### Nets
1: S1.2(A')
1.2VD: C11.1(A) C12.1(A) C13.1(A) C14.1(A) C15.1(A) C16.1(A) C17.1(A) C18.1(A) C19.1(A) C20.1(A) C21.1(A) C22.1(A) C58.1(A) U6.16(VDD) U6.21(VDD) U6.61(VDD) U6.76(VDD) U6.117(VDD) U6.126(VDD) U6.137(VDD) U6.153(VDD) U6.158(VDD) U6.169(VDD) U15.5(OUT)
3: S1.4(B')
3.3VD: C23.1(A) C24.1(A) C25.1(A) C26.1(A) C27.1(A) C28.1(A) C29.1(A) C30.1(A) C31.1(A) C32.1(A) C33.1(A) C34.1(A) C35.1(A) C36.1(A) C37.1(A) C38.1(A) C39.1(A) C40.1(A) C41.1(A) C42.1(A) C43.1(A) C44.1(A) C45.1(A) C46.1(A) C55.1(A) C57.1(A) DSP_JTAG.5(PD_3.3V) R6.2(B) R9.1(A) R11.1(A) R12.1(A) R14.1(A) R15.2(B) R16.2(B) R25.1(A) R26.1(A) R39.1(A) R44.1(A) R45.1(A) U3.16(VDD) U6.3(VDDIO) U6.11(VDDIO) U6.15(VDDIO) U6.20(VDDIO) U6.26(VDDIO) U6.36(VDDA) U6.54(VDDA) U6.62(VDDIO) U6.68(VDDIO) U6.72(VDD3VFL) U6.75(VDDIO) U6.82(VDDIO) U6.88(VDDIO) U6.91(VDDIO) U6.99(VDDIO) U6.106(VDDIO) U6.114(VDDIO) U6.116(VDDIO) U6.119(VREGENZ) U6.120(VDDOSC) U6.122(VSSOSC) U6.125(VDDOSC) U6.127(VDDIO) U6.138(VDDIO) U6.147(VDDIO) U6.152(VDDIO) U6.159(VDDIO) U6.168(VDDIO) U8.3(OUT) U15.1(IN)
5VD: R13.1(A) U7.13(VCC) U8.4(IN) ; port 5VD
DGND: C9.2(B) C11.2(B) C12.2(B) C13.2(B) C14.2(B) C15.2(B) C16.2(B) C17.2(B) C18.2(B) C19.2(B) C20.2(B) C21.2(B) C22.2(B) C23.2(B) C24.2(B) C25.2(B) C26.2(B) C27.2(B) C28.2(B) C29.2(B) C30.2(B) C31.2(B) C32.2(B) C33.2(B) C34.2(B) C35.2(B) C36.2(B) C37.2(B) C38.2(B) C39.2(B) C40.2(B) C41.2(B) C42.2(B) C43.2(B) C44.2(B) C45.2(B) C46.2(B) C55.2(B) C56.1(A) C57.2(B) C58.2(B) C59.2(B) D2.1(K) D5#2.1(K) D9.1(K) DGND.1 DSP_JTAG.4(GND) DSP_JTAG.8(GND) DSP_JTAG.10(GND) DSP_JTAG.12(GND) P2.5(GND) P2.SHD R18.1(A) R19.1(A) R20.2(B) R28.1(A) R29.1(A) R30.1(A) R31.1(A) R32.1(A) R33.1(A) R43.1(A) S1.1(A) S1.2(A') U3.9(DGND) U6.34(VSSA) U6.52(VSSA) U6.123(X1) U6.177(PWRPAD) U7.4(GND) U7.14(GND) U8.5(GND) U15.2(GND)
A0: U6.85(GPIO38) ; port Address.A0
A1: U6.86(GPIO39) ; port Address.A1
A2: U6.87(GPIO40) ; port Address.A2
A3: U6.89(GPIO41) ; port Address.A3
A4: U6.113(GPIO44) ; port Address.A4
A5: U6.115(GPIO45) ; port Address.A5
A6: U6.128(GPIO46) ; port Address.A6
A7: U6.129(GPIO47) ; port Address.A7
A8: U6.90(GPIO48) ; port Address.A8
A9: U6.93(GPIO49) ; port Address.A9
A10: U6.94(GPIO50) ; port Address.A10
A11: U6.95(GPIO51) ; port Address.A11
A12: U6.96(GPIO52) ; port Address.A12
A13: R29.2(B) U6.97(GPIO53) ; port Address.A13
A14: R30.2(B) U6.98(GPIO54) ; port Address.A14
A15: R31.2(B) U6.100(GPIO55) ; port Address.A15
A16: R32.2(B) U6.101(GPIO56) ; port Address.A16
A17: R33.2(B) U6.102(GPIO57) ; port Address.A17
AGND1: U3.21(AGND1)
AGND2: U3.1(AGND2)
AGND3: U3.17(AGND3)
AGND4: U3.5(AGND4)
BootMode0: R18.2(B) S2.1(A1) U6.154(GPIO84)
~{CS_POT}: U3.11(~{CS}) U6.12(GPIO19)
~{CS_TB}: SPI_OUT.1 U6.23(GPIO23) U7.3(~{SS})
D0: U6.155(GPIO85) ; port Data.D0
D1: U6.151(GPIO83) ; port Data.D1
D2: U6.150(GPIO82) ; port Data.D2
D3: U6.149(GPIO81) ; port Data.D3
D4: U6.148(GPIO80) ; port Data.D4
D5: U6.146(GPIO79) ; port Data.D5
D6: U6.145(GPIO78) ; port Data.D6
D7: U6.144(GPIO77) ; port Data.D7
D8: U6.143(GPIO76) ; port Data.D8
D9: U6.142(GPIO75) ; port Data.D9
D10: U6.141(GPIO74) ; port Data.D10
D11: U6.140(GPIO73) ; port Data.D11
D12: port Data.D12
D12/BootMode1: R19.2(B) S2.2(A2) U6.139(GPIO72)
D13: U6.136(GPIO71) ; port Data.D13
D14: U6.135(GPIO70) ; port Data.D14
D15: U6.134(GPIO69) ; port Data.D15
DM: R40.1(A) U7.15(DM)
DP: R41.1(A) U7.16(DP)
DSP_CTRL1: U6.1(GPIO10) ; port DSP_CTRL.CTRL1
DSP_CTRL2: U6.2(GPIO11) ; port DSP_CTRL.CTRL2
DSP_CTRL3: U6.4(GPIO12) ; port DSP_CTRL.CTRL3
DSP_CTRL4: U6.5(GPIO13) ; port DSP_CTRL.CTRL4
DSP_CTRL5: U6.6(GPIO14) ; port DSP_CTRL.CTRL5
DSP_CTRL6: U6.7(GPIO15) ; port DSP_CTRL.CTRL6
~{EM_0E}: U6.84(GPIO37) ; port ~{EM_0E}
~{EM_CS2}: U6.70(GPIO34) ; port ~{EM_CS2}
~{EM_WE}: U6.66(GPIO31) ; port ~{EM_WE}
EMU0: DSP_JTAG.13(EMU0) R25.2(B)
EMU1: DSP_JTAG.14(EMU1) R26.2(B)
~{RST}: C9.1(A) D4.1(K) R11.2(B) S1.3(B) S1.4(B') U6.124(XRS_N)
~{RST_POT}: R6.1(A) U3.15(~{RS})
RGA_1: SPI_RES.1
RGA_1i: SPI_RES.2 U3.22(W1) U3.23(A1)
RGA_2: SPI_RES.5
RGA_2i: SPI_RES.6 U3.3(A2) U3.4(W2)
RGA_3: SPI_RES.9
RGA_3i: SPI_RES.10 U3.18(W3) U3.19(A3)
RGA_4: SPI_RES.13
RGA_4i: SPI_RES.14 U3.7(A4) U3.8(W4)
RGB_1: SPI_RES.3
RGB_1i: SPI_RES.4 U3.24(B1)
RGB_2: SPI_RES.7
RGB_2i: SPI_RES.8 U3.2(B2)
RGB_3: SPI_RES.11
RGB_3i: SPI_RES.12 U3.20(B3)
RGB_4: SPI_RES.15
RGB_4i: SPI_RES.16 U3.6(B4)
SCK_POT: U3.14(CLK) U6.10(GPIO18)
SCK_TB: SPI_OUT.4 U6.22(GPIO22) U7.2(SCK)
SIMO_POT: U3.12(SDI) U6.8(GPIO16)
SIMO_TB: SPI_OUT.3 U6.24(GPIO24) U7.9(MOSI)
SOMI_POT: U3.13(SDO) U6.9(GPIO17)
SOMI_TB: SPI_OUT.2 U6.25(GPIO25) U7.8(MISO)
~{TRST}: R28.2(B) S2.3(A3) U6.79(TRST_N)
~{TRST}_JTAG: DSP_JTAG.2(TRST-) S2.4(B3)
TCK: DSP_JTAG.9(TCK_RST) DSP_JTAG.11(TCK) U6.81(TCK)
TD0: DSP_JTAG.7(TDO) U6.78(TDO)
TDI: DSP_JTAG.3(TDI) U6.77(TDI)
TMS: DSP_JTAG.1(TMS) U6.80(TMS)
VBUS: R27.2(B) R43.2(B) U7.10(VBUS_S)
Vout3v3: R42.1(A) U7.5(VCCIO) U7.11(~{RST}) U7.12(Vout3V3)
NetC56_2: C56.2(B) P2.2(D-) R20.1(A) R40.2(B)
NetC59_1: C59.1(A) P2.3(D+) R41.2(B) R42.2(B)
NetD2_2: D2.2(A) R34.1(A)
NetD4_2: D4.2(A) R12.2(B)
NetD5#2_2: D5#2.2(A) R24.1(A)
NetD9_2: D9.2(A) R14.2(B)
NetP2_1: P2.1(VBUS) R27.1(A)
NetR9_2: R9.2(B) U3.10(~{SHDN})
NetR13_2: R13.2(B) U8.1(EN)
NetR15_1: R15.1(A) S2.6(B1)
NetR16_1: R16.1(A) S2.5(B2)
NetR24_2: R24.2(B) U6.65(GPIO29)
NetR34_2: R34.2(B) U6.64(GPIO28)
NetR39_2: R39.2(B) U15.3(EN)
NetR44_2: R44.2(B) U7.7(~{INT})
NetR45_2: R45.2(B) U7.6(SUSPEND)

Not connected (* = marked no-connect by the designer): DSP_JTAG 6(NC); P2 4(ID); U6 13(GPIO20) 14(GPIO21) 17(GPIO99) 18(GPIO8) 19(GPIO9) 27(GPIO26) 28(GPIO27) 63(GPIO30) 67(GPIO32) 69(GPIO33) 71(GPIO35) 73(FLT1) 74(FLT2) 83(GPIO36) 92(ERRORSTS) 103(GPIO58) 104(GPIO59) 105(GPIO60) 107(GPIO61) 108(GPIO62) 109(GPIO63) 110(GPIO64) 111(GPIO65) 112(GPIO66) 118(GPIO133) 121(X2) 130(GPIO42) 131(GPIO43) 132(GPIO67) 133(GPIO68) 156(GPIO86) 157(GPIO87) 160(GPIO0) 161(GPIO1) 162(GPIO2) 163(GPIO3) 164(GPIO4) 165(GPIO5) 166(GPIO6) 167(GPIO7) 170(GPIO88) 171(GPIO89) 172(GPIO90) 173(GPIO91) 174(GPIO92) 175(GPIO93) 176(GPIO94); U7 1(~{BCD}); U8 2(NC); U15 4(NC)

### Buses and harness runs
bus AGND1..4] = port AGND[1..4]
bus RGA_[1..4] = port RGA_[1..4]
bus RGB_[1..4] = port RGB_[1..4]

### Notes on the sheet
- (near U3) SPI Controlled 100k Pot provides adj. gain

### Library data of the parts
C55-C59 = Cap1206: CAP CER 1UF 50V 10% X7R 1206; Supplier 1: Digi-Key; Supplier Part Number 1: 587-2230-1-ND
D2 D4 D5#2 D9 = LED-RED: as D1 on sheet Analog_Test; Color: Red; Supplier: Digi-Key; Package / Case: 0805 (2012 Metric)
  D2 D5#2 D9: Supplier Part Number: 160-1421-1-ND
DGND = Test_Point: TEST POINT PC COMPACT .063"D; Supplier 1: Digi-Key; Supplier Part Number 1: 5006K-ND
DSP_JTAG = JTAG-TI_14: 14 Pin JTAG Header
P2 = USB Micro: USB Mini B Metal Shield SMT; Supplier 1: Digi-Key; Supplier Part Number 1: 609-4613-1-ND
S1 = SW-PB: Push Button Switch; Manufacturer: Panasonic Electronic Components; Manufacturer Part Number: EVQ-9P105M; Outline: 6.10mm x 6.00mm; Actuator Orientation: Top Actuated; Actuator Height off PCB, from Pins: 5.00mm; Published: 24-Mar-1999; LatestRevisionDate: 17-Jul-2002; LatestRevisionNote: Re-released for DXP Platform.; PackageReference: SPST-2; Publisher: Altium Limited; PackageDescription: Switch; 2 Leads; Supplier: Digi-Key; Supplier Part Number: P13586SCT-ND
S2 = SW DIP-3: DIP Switch, 3 Position, SPST; Published: 24-Mar-1999; LatestRevisionDate: 17-Jul-2002; LatestRevisionNote: Re-released for DXP Platform.; PackageReference: DIP-6; Publisher: Altium Limited; Code_JEDEC: MO-001-AM
SPI_OUT = MOLEX-HDR-1x4-SHERLOCK_RA: Header, Molex, 2mm Pitch Sherlock Header, Single Row, Horizontal, 4 Circuits, Length 3.3mm; Manufacturer Part Number: 0353630460; Supplier Part Number 1: WM18933-ND; Manufacturer: Molex; Supplier 1: Digikey
SPI_RES = Header 8X2: Header, 8-Pin, Dual row; LatestRevisionDate: 17-Jul-2002; LatestRevisionNote: Re-released for DXP Platform.; Publisher: Altium Limited
U3 = AD8403: IC POT DGTL 8BIT 100K 4CH 24SOIC; Supplier 1: Digi-Key; Supplier Part Number 1: AD8403ARZ100-ND
U6 = TMS320F28377SPTP: IC MCU 32BIT 1024KB 176LQFP; Manufacturer: Texas Instruments; PIN_COUNT: 177; PartNumber: TMS320F28377SPTP; PackageReference: PTP0176F; MountType: SMT; CompType: IC; RoHS: Y; RefDes: RefDes; Type: DEV; Value: Value; Supplier Part Number 1: 296-39643-ND; Supplier 1: Digi-Key
U7 = FT121T-R: IC USB CONTROLLER SPI 16-TSSOP; Supplier 1: Digi-Key; Supplier Part Number 1: 768-1167-1-ND
U8 = LP38691: IC REG LDO 3.3V 0.5A SOT223-5; Supplier 1: Digi-Key; Supplier Part Number 1: LP38693MP-3.3/NOPBCT-ND
U15 = LP3990MF-1.2: IC REG LDO 1.2V 0.15A SOT23-5; Supplier 1: Digi-Key; Supplier Part Number 1: LP3990MF-1.2/NOPBCT-ND
C9 C11-C46 = Cap: Supplier 1: Digi-Key; Supplier Part Number 1: 1276-1000-1-ND
R6 R9 R11-R16 R18-R20 R24-R34 R39-R45 = Res: Supplier 1: Digi-Key; Supplier Part Number 1: RMCF0603JT10K0CT-ND

## Nets that join several sheets
3.3VD: A1 (U2_A1.16), A2 (U2_A2.16), A3 (U2_A3.16), A4 (U2_A4.16), Digital_SRAM (U14.11 U14.33), Digital_CPLD (10 pins), Digital_DSP (70 pins)
5VD: A1 (FB1_A1.1), A2 (FB1_A2.1), A3 (FB1_A3.1), A4 (FB1_A4.1), Power_Supply (5V.2), Digital_DSP (R13.1 U7.13 U8.4)
DGND: A1 (NT1_A1.2 U2_A1.14), A2 (NT1_A2.2 U2_A2.14), A3 (NT1_A3.2 U2_A3.14), A4 (NT1_A4.2 U2_A4.14), Power_Supply (10 pins), Digital_SRAM (U14.12 U14.34 U14.39 U14.40), Digital_CPLD (19 pins), Digital_DSP (73 pins)
~{CONVST}_1: A1 (U2_A1.9), Digital_CPLD (U12.6)
~{CONVST}_2: A2 (U2_A2.9), Digital_CPLD (U12.16)
~{CONVST}_3: A3 (U2_A3.9), Digital_CPLD (U12.26)
~{CONVST}_4: A4 (U2_A4.9), Digital_CPLD (U12.34)
~{EM_CS}: Digital_SRAM (U14.6), Digital_CPLD (U12.73)
~{EM_OE}: Digital_SRAM (U14.41), Digital_CPLD (U12.100)
~{EM_WE}: Digital_SRAM (U14.17), Digital_CPLD (U12.72)
EOC_1: A1 (U2_A1.10), Digital_CPLD (U12.5)
EOC_2: A2 (U2_A2.10), Digital_CPLD (U12.15)
EOC_3: A3 (U2_A3.10), Digital_CPLD (U12.21)
EOC_4: A4 (U2_A4.10), Digital_CPLD (U12.33)
SPI_CE1: A1 (U2_A1.11), Digital_CPLD (CE1.1 U12.4)
SPI_CE2: A2 (U2_A2.11), Digital_CPLD (CE2.1 U12.14)
SPI_CE3: A3 (U2_A3.11), Digital_CPLD (CE3.1 U12.20)
SPI_CE4: A4 (U2_A4.11), Digital_CPLD (CE4.1 U12.30)
SPI_CLK/XA15: Digital_SRAM (U14.42), Digital_CPLD (U12.97)
SPI_CS/XA14: Digital_SRAM (U14.27), Digital_CPLD (U12.96)
SPI_MISO1: A1 (U2_A1.13), Digital_CPLD (MISO1.1 U12.2)
SPI_MISO2: A2 (U2_A2.13), Digital_CPLD (MISO2.1 U12.8)
SPI_MISO3: A3 (U2_A3.13), Digital_CPLD (MISO3.1 U12.18)
SPI_MISO4: A4 (U2_A4.13), Digital_CPLD (MISO4.1 U12.28)
SPI_MOSI1: A1 (U2_A1.12), Digital_CPLD (MOSI1.1 U12.3)
SPI_MOSI2: A2 (U2_A2.12), Digital_CPLD (MOSI2.1 U12.12)
SPI_MOSI3: A3 (U2_A3.12), Digital_CPLD (MOSI3.1 U12.19)
SPI_MOSI4: A4 (U2_A4.12), Digital_CPLD (MOSI4.1 U12.29)
SPI_SCK1: A1 (U2_A1.15), Digital_CPLD (SCK1.1 U12.1)
SPI_SCK2: A2 (U2_A2.15), Digital_CPLD (SCK2.1 U12.7)
SPI_SCK3: A3 (U2_A3.15), Digital_CPLD (SCK3.1 U12.17)
SPI_SCK4: A4 (U2_A4.15), Digital_CPLD (SCK4.1 U12.27)
SPI_SIMO/XA17: Digital_SRAM (U14.44), Digital_CPLD (U12.99)
SPI_SOMI/XA16: Digital_SRAM (U14.43), Digital_CPLD (U12.98)
XA0: Digital_SRAM (U14.1), Digital_CPLD (U12.76)
XA1: Digital_SRAM (U14.2), Digital_CPLD (U12.77)
XA2: Digital_SRAM (U14.3), Digital_CPLD (U12.78)
XA3: Digital_SRAM (U14.4), Digital_CPLD (U12.81)
XA4: Digital_SRAM (U14.5), Digital_CPLD (U12.82)
XA5: Digital_SRAM (U14.18), Digital_CPLD (U12.83)
XA6: Digital_SRAM (U14.19), Digital_CPLD (U12.84)
XA7: Digital_SRAM (U14.20), Digital_CPLD (U12.85)
XA8: Digital_SRAM (U14.21), Digital_CPLD (U12.86)
XA9: Digital_SRAM (U14.22), Digital_CPLD (U12.87)
XA10: Digital_SRAM (U14.23), Digital_CPLD (U12.89)
XA11: Digital_SRAM (U14.24), Digital_CPLD (U12.91)
XA12: Digital_SRAM (U14.25), Digital_CPLD (U12.92)
XA13: Digital_SRAM (U14.26), Digital_CPLD (U12.95)
XD0: Digital_SRAM (U14.7), Digital_CPLD (U12.51)
XD1: Digital_SRAM (U14.8), Digital_CPLD (U12.52)
XD2: Digital_SRAM (U14.9), Digital_CPLD (U12.53)
XD3: Digital_SRAM (U14.10), Digital_CPLD (U12.54)
XD4: Digital_SRAM (U14.13), Digital_CPLD (U12.55)
XD5: Digital_SRAM (U14.14), Digital_CPLD (U12.56)
XD6: Digital_SRAM (U14.15), Digital_CPLD (U12.57)
XD7: Digital_SRAM (U14.16), Digital_CPLD (U12.58)
XD8: Digital_SRAM (U14.29), Digital_CPLD (U12.61)
XD9: Digital_SRAM (U14.30), Digital_CPLD (U12.62)
XD10: Digital_SRAM (U14.31), Digital_CPLD (U12.66)
XD11: Digital_SRAM (U14.32), Digital_CPLD (U12.67)
XD12: Digital_SRAM (U14.35), Digital_CPLD (U12.68)
XD13: Digital_SRAM (U14.36), Digital_CPLD (U12.69)
XD14: Digital_SRAM (U14.37), Digital_CPLD (U12.70)
XD15: Digital_SRAM (U14.38), Digital_CPLD (U12.71)